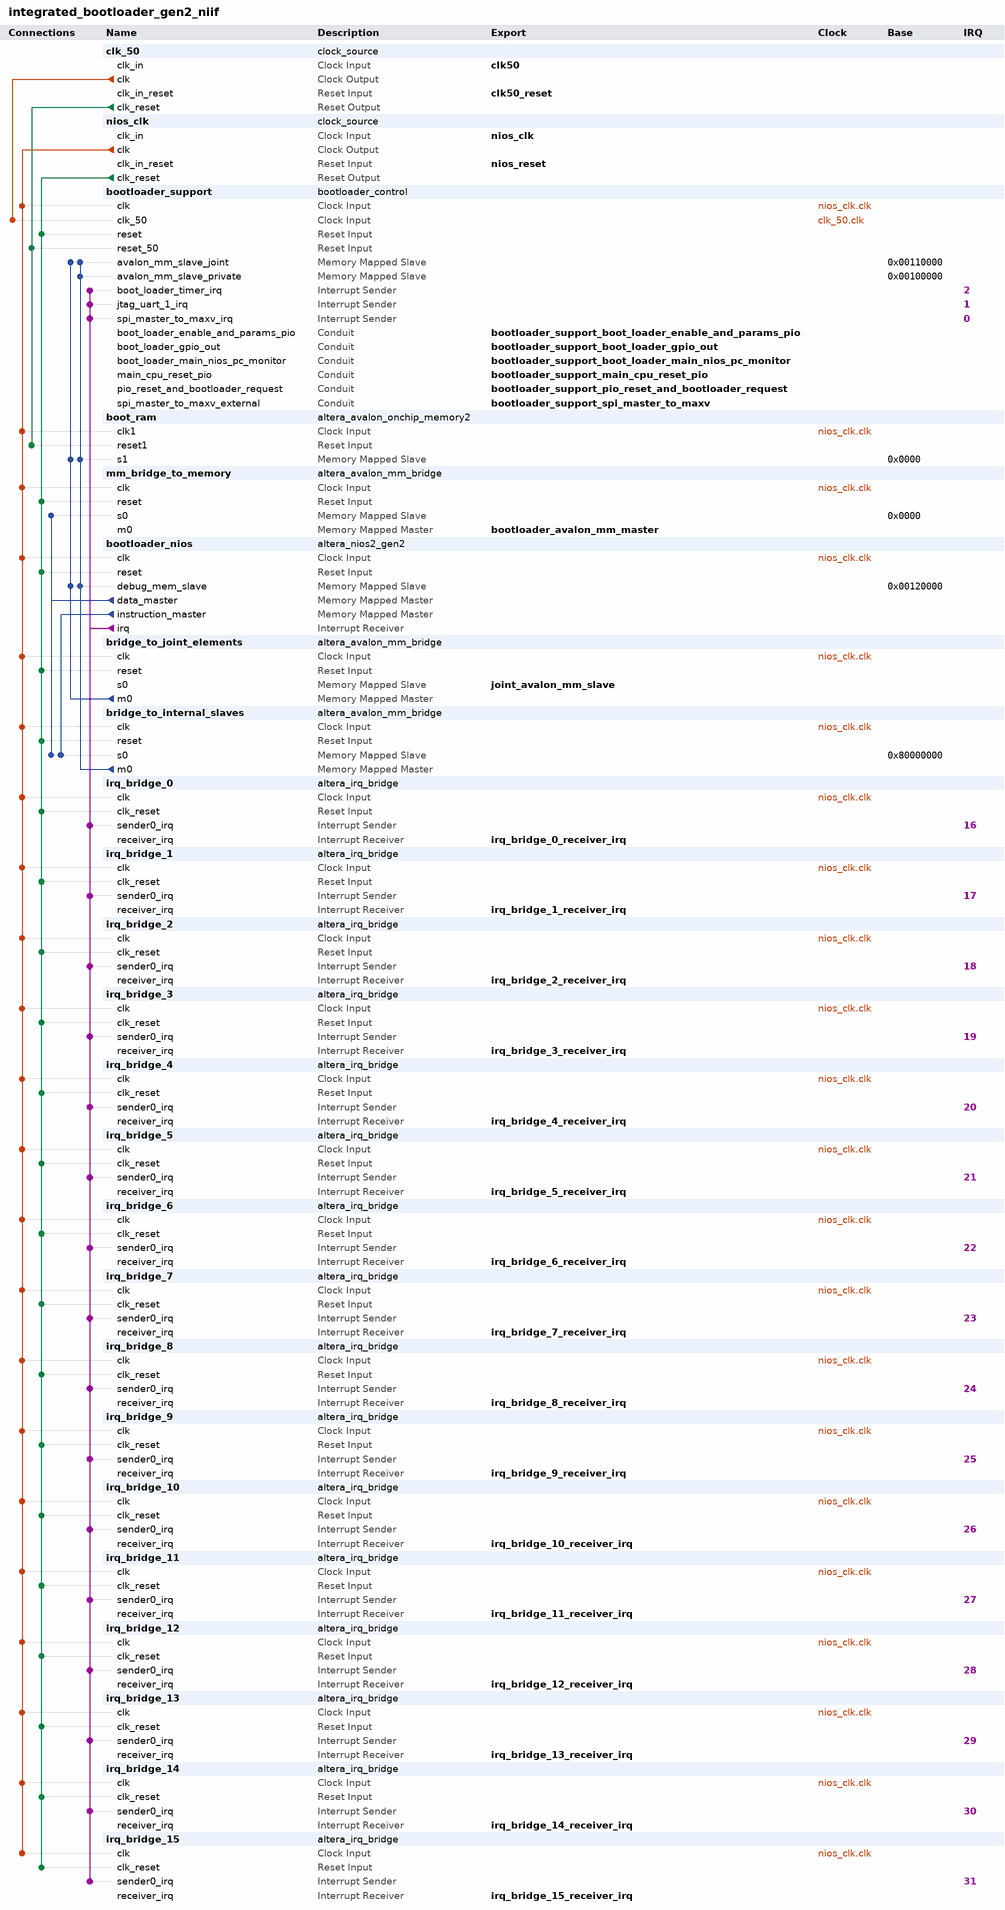
[diagram p0: system contents]
# Platform Designer (Qsys) system integrated_bootloader_gen2_niif, Cyclone V 5CGTFD9E5F35C7
# Parameters at their usual value, and those the tool derives, are not listed.
package require -exact qsys 16.1
create_system integrated_bootloader_gen2_niif
set_project_property DEVICE_FAMILY {Cyclone V}
set_project_property DEVICE 5CGTFD9E5F35C7

add_instance clk_50 clock_source 16.1
set_instance_parameter_value clk_50 clockFrequency 50000000
set_instance_parameter_value clk_50 resetSynchronousEdges BOTH

add_instance nios_clk clock_source 16.1
set_instance_parameter_value nios_clk clockFrequency 50000000
set_instance_parameter_value nios_clk clockFrequencyKnown false
set_instance_parameter_value nios_clk resetSynchronousEdges BOTH

add_instance bootloader_support bootloader_control 1.0
set_instance_parameter_value bootloader_support LEGACY_ITEMS_SUSBSYTEM_ENABLED 0
set_instance_parameter_value bootloader_support VME_FIFO_SUBSYSTEM_ENABLED 0

add_instance boot_ram altera_avalon_onchip_memory2 16.1
set_instance_parameter_value boot_ram allowInSystemMemoryContentEditor true
set_instance_parameter_value boot_ram dataWidth 32
set_instance_parameter_value boot_ram dualPort false
set_instance_parameter_value boot_ram initMemContent true
set_instance_parameter_value boot_ram initializationFileName bootloader_nios_code.hex
set_instance_parameter_value boot_ram instanceID b007
set_instance_parameter_value boot_ram memorySize 1048576
set_instance_parameter_value boot_ram slave1Latency 2
set_instance_parameter_value boot_ram useNonDefaultInitFile true

add_instance mm_bridge_to_memory altera_avalon_mm_bridge 16.1
set_instance_parameter_value mm_bridge_to_memory ADDRESS_UNITS SYMBOLS
set_instance_parameter_value mm_bridge_to_memory ADDRESS_WIDTH 31
set_instance_parameter_value mm_bridge_to_memory DATA_WIDTH 32
set_instance_parameter_value mm_bridge_to_memory MAX_BURST_SIZE 4
set_instance_parameter_value mm_bridge_to_memory MAX_PENDING_RESPONSES 4
set_instance_parameter_value mm_bridge_to_memory USE_AUTO_ADDRESS_WIDTH 0

add_instance bootloader_nios altera_nios2_gen2 16.1
set_instance_parameter_value bootloader_nios cpuID 45063
set_instance_parameter_value bootloader_nios dcache_size 0
set_instance_parameter_value bootloader_nios exceptionSlave boot_ram.s1
set_instance_parameter_value bootloader_nios icache_size 2048
set_instance_parameter_value bootloader_nios impl Fast
set_instance_parameter_value bootloader_nios resetSlave boot_ram.s1
set_instance_parameter_value bootloader_nios setting_support31bitdcachebypass false

add_instance bridge_to_joint_elements altera_avalon_mm_bridge 16.1
set_instance_parameter_value bridge_to_joint_elements ADDRESS_UNITS SYMBOLS
set_instance_parameter_value bridge_to_joint_elements ADDRESS_WIDTH 10
set_instance_parameter_value bridge_to_joint_elements DATA_WIDTH 32
set_instance_parameter_value bridge_to_joint_elements MAX_PENDING_RESPONSES 4
set_instance_parameter_value bridge_to_joint_elements USE_AUTO_ADDRESS_WIDTH 1

add_instance bridge_to_internal_slaves altera_avalon_mm_bridge 16.1
set_instance_parameter_value bridge_to_internal_slaves ADDRESS_UNITS SYMBOLS
set_instance_parameter_value bridge_to_internal_slaves ADDRESS_WIDTH 21
set_instance_parameter_value bridge_to_internal_slaves DATA_WIDTH 32
set_instance_parameter_value bridge_to_internal_slaves MAX_PENDING_RESPONSES 4
set_instance_parameter_value bridge_to_internal_slaves USE_AUTO_ADDRESS_WIDTH 0

add_instance irq_bridge_0 altera_irq_bridge 16.1
set_instance_parameter_value irq_bridge_0 IRQ_WIDTH 1

add_instance irq_bridge_1 altera_irq_bridge 16.1
set_instance_parameter_value irq_bridge_1 IRQ_WIDTH 1

add_instance irq_bridge_2 altera_irq_bridge 16.1
set_instance_parameter_value irq_bridge_2 IRQ_WIDTH 1

add_instance irq_bridge_3 altera_irq_bridge 16.1
set_instance_parameter_value irq_bridge_3 IRQ_WIDTH 1

add_instance irq_bridge_4 altera_irq_bridge 16.1
set_instance_parameter_value irq_bridge_4 IRQ_WIDTH 1

add_instance irq_bridge_5 altera_irq_bridge 16.1
set_instance_parameter_value irq_bridge_5 IRQ_WIDTH 1

add_instance irq_bridge_6 altera_irq_bridge 16.1
set_instance_parameter_value irq_bridge_6 IRQ_WIDTH 1

add_instance irq_bridge_7 altera_irq_bridge 16.1
set_instance_parameter_value irq_bridge_7 IRQ_WIDTH 1

add_instance irq_bridge_8 altera_irq_bridge 16.1
set_instance_parameter_value irq_bridge_8 IRQ_WIDTH 1

add_instance irq_bridge_9 altera_irq_bridge 16.1
set_instance_parameter_value irq_bridge_9 IRQ_WIDTH 1

add_instance irq_bridge_10 altera_irq_bridge 16.1
set_instance_parameter_value irq_bridge_10 IRQ_WIDTH 1

add_instance irq_bridge_11 altera_irq_bridge 16.1
set_instance_parameter_value irq_bridge_11 IRQ_WIDTH 1

add_instance irq_bridge_12 altera_irq_bridge 16.1
set_instance_parameter_value irq_bridge_12 IRQ_WIDTH 1

add_instance irq_bridge_13 altera_irq_bridge 16.1
set_instance_parameter_value irq_bridge_13 IRQ_WIDTH 1

add_instance irq_bridge_14 altera_irq_bridge 16.1
set_instance_parameter_value irq_bridge_14 IRQ_WIDTH 1

add_instance irq_bridge_15 altera_irq_bridge 16.1
set_instance_parameter_value irq_bridge_15 IRQ_WIDTH 1

# connections
add_connection clk_50.clk bootloader_support.clk_50 clock
add_connection nios_clk.clk boot_ram.clk1 clock
add_connection nios_clk.clk bootloader_nios.clk clock
add_connection nios_clk.clk bootloader_support.clk clock
add_connection nios_clk.clk bridge_to_internal_slaves.clk clock
add_connection nios_clk.clk bridge_to_joint_elements.clk clock
add_connection nios_clk.clk irq_bridge_0.clk clock
add_connection nios_clk.clk irq_bridge_1.clk clock
add_connection nios_clk.clk irq_bridge_2.clk clock
add_connection nios_clk.clk irq_bridge_3.clk clock
add_connection nios_clk.clk irq_bridge_4.clk clock
add_connection nios_clk.clk irq_bridge_5.clk clock
add_connection nios_clk.clk irq_bridge_6.clk clock
add_connection nios_clk.clk irq_bridge_7.clk clock
add_connection nios_clk.clk irq_bridge_8.clk clock
add_connection nios_clk.clk irq_bridge_9.clk clock
add_connection nios_clk.clk irq_bridge_10.clk clock
add_connection nios_clk.clk irq_bridge_11.clk clock
add_connection nios_clk.clk irq_bridge_12.clk clock
add_connection nios_clk.clk irq_bridge_13.clk clock
add_connection nios_clk.clk irq_bridge_14.clk clock
add_connection nios_clk.clk irq_bridge_15.clk clock
add_connection nios_clk.clk mm_bridge_to_memory.clk clock
add_connection clk_50.clk_reset boot_ram.reset1 reset
add_connection clk_50.clk_reset bootloader_support.reset_50 reset
add_connection nios_clk.clk_reset bootloader_nios.reset reset
add_connection nios_clk.clk_reset bootloader_support.reset reset
add_connection nios_clk.clk_reset bridge_to_internal_slaves.reset reset
add_connection nios_clk.clk_reset bridge_to_joint_elements.reset reset
add_connection nios_clk.clk_reset irq_bridge_0.clk_reset reset
add_connection nios_clk.clk_reset irq_bridge_1.clk_reset reset
add_connection nios_clk.clk_reset irq_bridge_2.clk_reset reset
add_connection nios_clk.clk_reset irq_bridge_3.clk_reset reset
add_connection nios_clk.clk_reset irq_bridge_4.clk_reset reset
add_connection nios_clk.clk_reset irq_bridge_5.clk_reset reset
add_connection nios_clk.clk_reset irq_bridge_6.clk_reset reset
add_connection nios_clk.clk_reset irq_bridge_7.clk_reset reset
add_connection nios_clk.clk_reset irq_bridge_8.clk_reset reset
add_connection nios_clk.clk_reset irq_bridge_9.clk_reset reset
add_connection nios_clk.clk_reset irq_bridge_10.clk_reset reset
add_connection nios_clk.clk_reset irq_bridge_11.clk_reset reset
add_connection nios_clk.clk_reset irq_bridge_12.clk_reset reset
add_connection nios_clk.clk_reset irq_bridge_13.clk_reset reset
add_connection nios_clk.clk_reset irq_bridge_14.clk_reset reset
add_connection nios_clk.clk_reset irq_bridge_15.clk_reset reset
add_connection nios_clk.clk_reset mm_bridge_to_memory.reset reset
add_connection bootloader_nios.data_master bridge_to_internal_slaves.s0 avalon
set_connection_parameter_value bootloader_nios.data_master/bridge_to_internal_slaves.s0 baseAddress 0x80000000
add_connection bootloader_nios.data_master mm_bridge_to_memory.s0 avalon
set_connection_parameter_value bootloader_nios.data_master/mm_bridge_to_memory.s0 baseAddress 0x0000
add_connection bootloader_nios.instruction_master bridge_to_internal_slaves.s0 avalon
set_connection_parameter_value bootloader_nios.instruction_master/bridge_to_internal_slaves.s0 baseAddress 0x80000000
add_connection bridge_to_internal_slaves.m0 boot_ram.s1 avalon
set_connection_parameter_value bridge_to_internal_slaves.m0/boot_ram.s1 baseAddress 0x0000
add_connection bridge_to_internal_slaves.m0 bootloader_nios.debug_mem_slave avalon
set_connection_parameter_value bridge_to_internal_slaves.m0/bootloader_nios.debug_mem_slave baseAddress 0x00120000
add_connection bridge_to_internal_slaves.m0 bootloader_support.avalon_mm_slave_joint avalon
set_connection_parameter_value bridge_to_internal_slaves.m0/bootloader_support.avalon_mm_slave_joint baseAddress 0x00110000
add_connection bridge_to_internal_slaves.m0 bootloader_support.avalon_mm_slave_private avalon
set_connection_parameter_value bridge_to_internal_slaves.m0/bootloader_support.avalon_mm_slave_private baseAddress 0x00100000
add_connection bridge_to_joint_elements.m0 boot_ram.s1 avalon
set_connection_parameter_value bridge_to_joint_elements.m0/boot_ram.s1 baseAddress 0x0000
add_connection bridge_to_joint_elements.m0 bootloader_nios.debug_mem_slave avalon
set_connection_parameter_value bridge_to_joint_elements.m0/bootloader_nios.debug_mem_slave baseAddress 0x00120000
add_connection bridge_to_joint_elements.m0 bootloader_support.avalon_mm_slave_joint avalon
set_connection_parameter_value bridge_to_joint_elements.m0/bootloader_support.avalon_mm_slave_joint baseAddress 0x00110000
add_connection bootloader_nios.irq bootloader_support.boot_loader_timer_irq interrupt
set_connection_parameter_value bootloader_nios.irq/bootloader_support.boot_loader_timer_irq irqNumber 2
add_connection bootloader_nios.irq bootloader_support.jtag_uart_1_irq interrupt
set_connection_parameter_value bootloader_nios.irq/bootloader_support.jtag_uart_1_irq irqNumber 1
add_connection bootloader_nios.irq bootloader_support.spi_master_to_maxv_irq interrupt
set_connection_parameter_value bootloader_nios.irq/bootloader_support.spi_master_to_maxv_irq irqNumber 0
add_connection bootloader_nios.irq irq_bridge_0.sender0_irq interrupt
set_connection_parameter_value bootloader_nios.irq/irq_bridge_0.sender0_irq irqNumber 16
add_connection bootloader_nios.irq irq_bridge_1.sender0_irq interrupt
set_connection_parameter_value bootloader_nios.irq/irq_bridge_1.sender0_irq irqNumber 17
add_connection bootloader_nios.irq irq_bridge_2.sender0_irq interrupt
set_connection_parameter_value bootloader_nios.irq/irq_bridge_2.sender0_irq irqNumber 18
add_connection bootloader_nios.irq irq_bridge_3.sender0_irq interrupt
set_connection_parameter_value bootloader_nios.irq/irq_bridge_3.sender0_irq irqNumber 19
add_connection bootloader_nios.irq irq_bridge_4.sender0_irq interrupt
set_connection_parameter_value bootloader_nios.irq/irq_bridge_4.sender0_irq irqNumber 20
add_connection bootloader_nios.irq irq_bridge_5.sender0_irq interrupt
set_connection_parameter_value bootloader_nios.irq/irq_bridge_5.sender0_irq irqNumber 21
add_connection bootloader_nios.irq irq_bridge_6.sender0_irq interrupt
set_connection_parameter_value bootloader_nios.irq/irq_bridge_6.sender0_irq irqNumber 22
add_connection bootloader_nios.irq irq_bridge_7.sender0_irq interrupt
set_connection_parameter_value bootloader_nios.irq/irq_bridge_7.sender0_irq irqNumber 23
add_connection bootloader_nios.irq irq_bridge_8.sender0_irq interrupt
set_connection_parameter_value bootloader_nios.irq/irq_bridge_8.sender0_irq irqNumber 24
add_connection bootloader_nios.irq irq_bridge_9.sender0_irq interrupt
set_connection_parameter_value bootloader_nios.irq/irq_bridge_9.sender0_irq irqNumber 25
add_connection bootloader_nios.irq irq_bridge_10.sender0_irq interrupt
set_connection_parameter_value bootloader_nios.irq/irq_bridge_10.sender0_irq irqNumber 26
add_connection bootloader_nios.irq irq_bridge_11.sender0_irq interrupt
set_connection_parameter_value bootloader_nios.irq/irq_bridge_11.sender0_irq irqNumber 27
add_connection bootloader_nios.irq irq_bridge_12.sender0_irq interrupt
set_connection_parameter_value bootloader_nios.irq/irq_bridge_12.sender0_irq irqNumber 28
add_connection bootloader_nios.irq irq_bridge_13.sender0_irq interrupt
set_connection_parameter_value bootloader_nios.irq/irq_bridge_13.sender0_irq irqNumber 29
add_connection bootloader_nios.irq irq_bridge_14.sender0_irq interrupt
set_connection_parameter_value bootloader_nios.irq/irq_bridge_14.sender0_irq irqNumber 30
add_connection bootloader_nios.irq irq_bridge_15.sender0_irq interrupt
set_connection_parameter_value bootloader_nios.irq/irq_bridge_15.sender0_irq irqNumber 31

# exported interfaces
add_interface bootloader_avalon_mm_master avalon master
set_interface_property bootloader_avalon_mm_master EXPORT_OF mm_bridge_to_memory.m0
add_interface bootloader_support_boot_loader_enable_and_params_pio conduit end
set_interface_property bootloader_support_boot_loader_enable_and_params_pio EXPORT_OF bootloader_support.boot_loader_enable_and_params_pio
add_interface bootloader_support_boot_loader_gpio_out conduit end
set_interface_property bootloader_support_boot_loader_gpio_out EXPORT_OF bootloader_support.boot_loader_gpio_out
add_interface bootloader_support_boot_loader_main_nios_pc_monitor conduit end
set_interface_property bootloader_support_boot_loader_main_nios_pc_monitor EXPORT_OF bootloader_support.boot_loader_main_nios_pc_monitor
add_interface bootloader_support_main_cpu_reset_pio conduit end
set_interface_property bootloader_support_main_cpu_reset_pio EXPORT_OF bootloader_support.main_cpu_reset_pio
add_interface bootloader_support_pio_reset_and_bootloader_request conduit end
set_interface_property bootloader_support_pio_reset_and_bootloader_request EXPORT_OF bootloader_support.pio_reset_and_bootloader_request
add_interface bootloader_support_spi_master_to_maxv conduit end
set_interface_property bootloader_support_spi_master_to_maxv EXPORT_OF bootloader_support.spi_master_to_maxv_external
add_interface clk50 clock sink
set_interface_property clk50 EXPORT_OF clk_50.clk_in
add_interface clk50_reset reset sink
set_interface_property clk50_reset EXPORT_OF clk_50.clk_in_reset
add_interface irq_bridge_0_receiver_irq interrupt receiver
set_interface_property irq_bridge_0_receiver_irq EXPORT_OF irq_bridge_0.receiver_irq
add_interface irq_bridge_10_receiver_irq interrupt receiver
set_interface_property irq_bridge_10_receiver_irq EXPORT_OF irq_bridge_10.receiver_irq
add_interface irq_bridge_11_receiver_irq interrupt receiver
set_interface_property irq_bridge_11_receiver_irq EXPORT_OF irq_bridge_11.receiver_irq
add_interface irq_bridge_12_receiver_irq interrupt receiver
set_interface_property irq_bridge_12_receiver_irq EXPORT_OF irq_bridge_12.receiver_irq
add_interface irq_bridge_13_receiver_irq interrupt receiver
set_interface_property irq_bridge_13_receiver_irq EXPORT_OF irq_bridge_13.receiver_irq
add_interface irq_bridge_14_receiver_irq interrupt receiver
set_interface_property irq_bridge_14_receiver_irq EXPORT_OF irq_bridge_14.receiver_irq
add_interface irq_bridge_15_receiver_irq interrupt receiver
set_interface_property irq_bridge_15_receiver_irq EXPORT_OF irq_bridge_15.receiver_irq
add_interface irq_bridge_1_receiver_irq interrupt receiver
set_interface_property irq_bridge_1_receiver_irq EXPORT_OF irq_bridge_1.receiver_irq
add_interface irq_bridge_2_receiver_irq interrupt receiver
set_interface_property irq_bridge_2_receiver_irq EXPORT_OF irq_bridge_2.receiver_irq
add_interface irq_bridge_3_receiver_irq interrupt receiver
set_interface_property irq_bridge_3_receiver_irq EXPORT_OF irq_bridge_3.receiver_irq
add_interface irq_bridge_4_receiver_irq interrupt receiver
set_interface_property irq_bridge_4_receiver_irq EXPORT_OF irq_bridge_4.receiver_irq
add_interface irq_bridge_5_receiver_irq interrupt receiver
set_interface_property irq_bridge_5_receiver_irq EXPORT_OF irq_bridge_5.receiver_irq
add_interface irq_bridge_6_receiver_irq interrupt receiver
set_interface_property irq_bridge_6_receiver_irq EXPORT_OF irq_bridge_6.receiver_irq
add_interface irq_bridge_7_receiver_irq interrupt receiver
set_interface_property irq_bridge_7_receiver_irq EXPORT_OF irq_bridge_7.receiver_irq
add_interface irq_bridge_8_receiver_irq interrupt receiver
set_interface_property irq_bridge_8_receiver_irq EXPORT_OF irq_bridge_8.receiver_irq
add_interface irq_bridge_9_receiver_irq interrupt receiver
set_interface_property irq_bridge_9_receiver_irq EXPORT_OF irq_bridge_9.receiver_irq
add_interface joint_avalon_mm_slave avalon slave
set_interface_property joint_avalon_mm_slave EXPORT_OF bridge_to_joint_elements.s0
add_interface nios_clk clock sink
set_interface_property nios_clk EXPORT_OF nios_clk.clk_in
add_interface nios_reset reset sink
set_interface_property nios_reset EXPORT_OF nios_clk.clk_in_reset

set_interconnect_requirement {$system} qsys_mm.burstAdapterImplementation PER_BURST_TYPE_CONVERTER
set_interconnect_requirement {$system} qsys_mm.clockCrossingAdapter AUTO
set_interconnect_requirement {$system} qsys_mm.maxAdditionalLatency 4

save_system integrated_bootloader_gen2_niif.qsys
